# Altium schematic sheet uicc.SchDoc
size A3
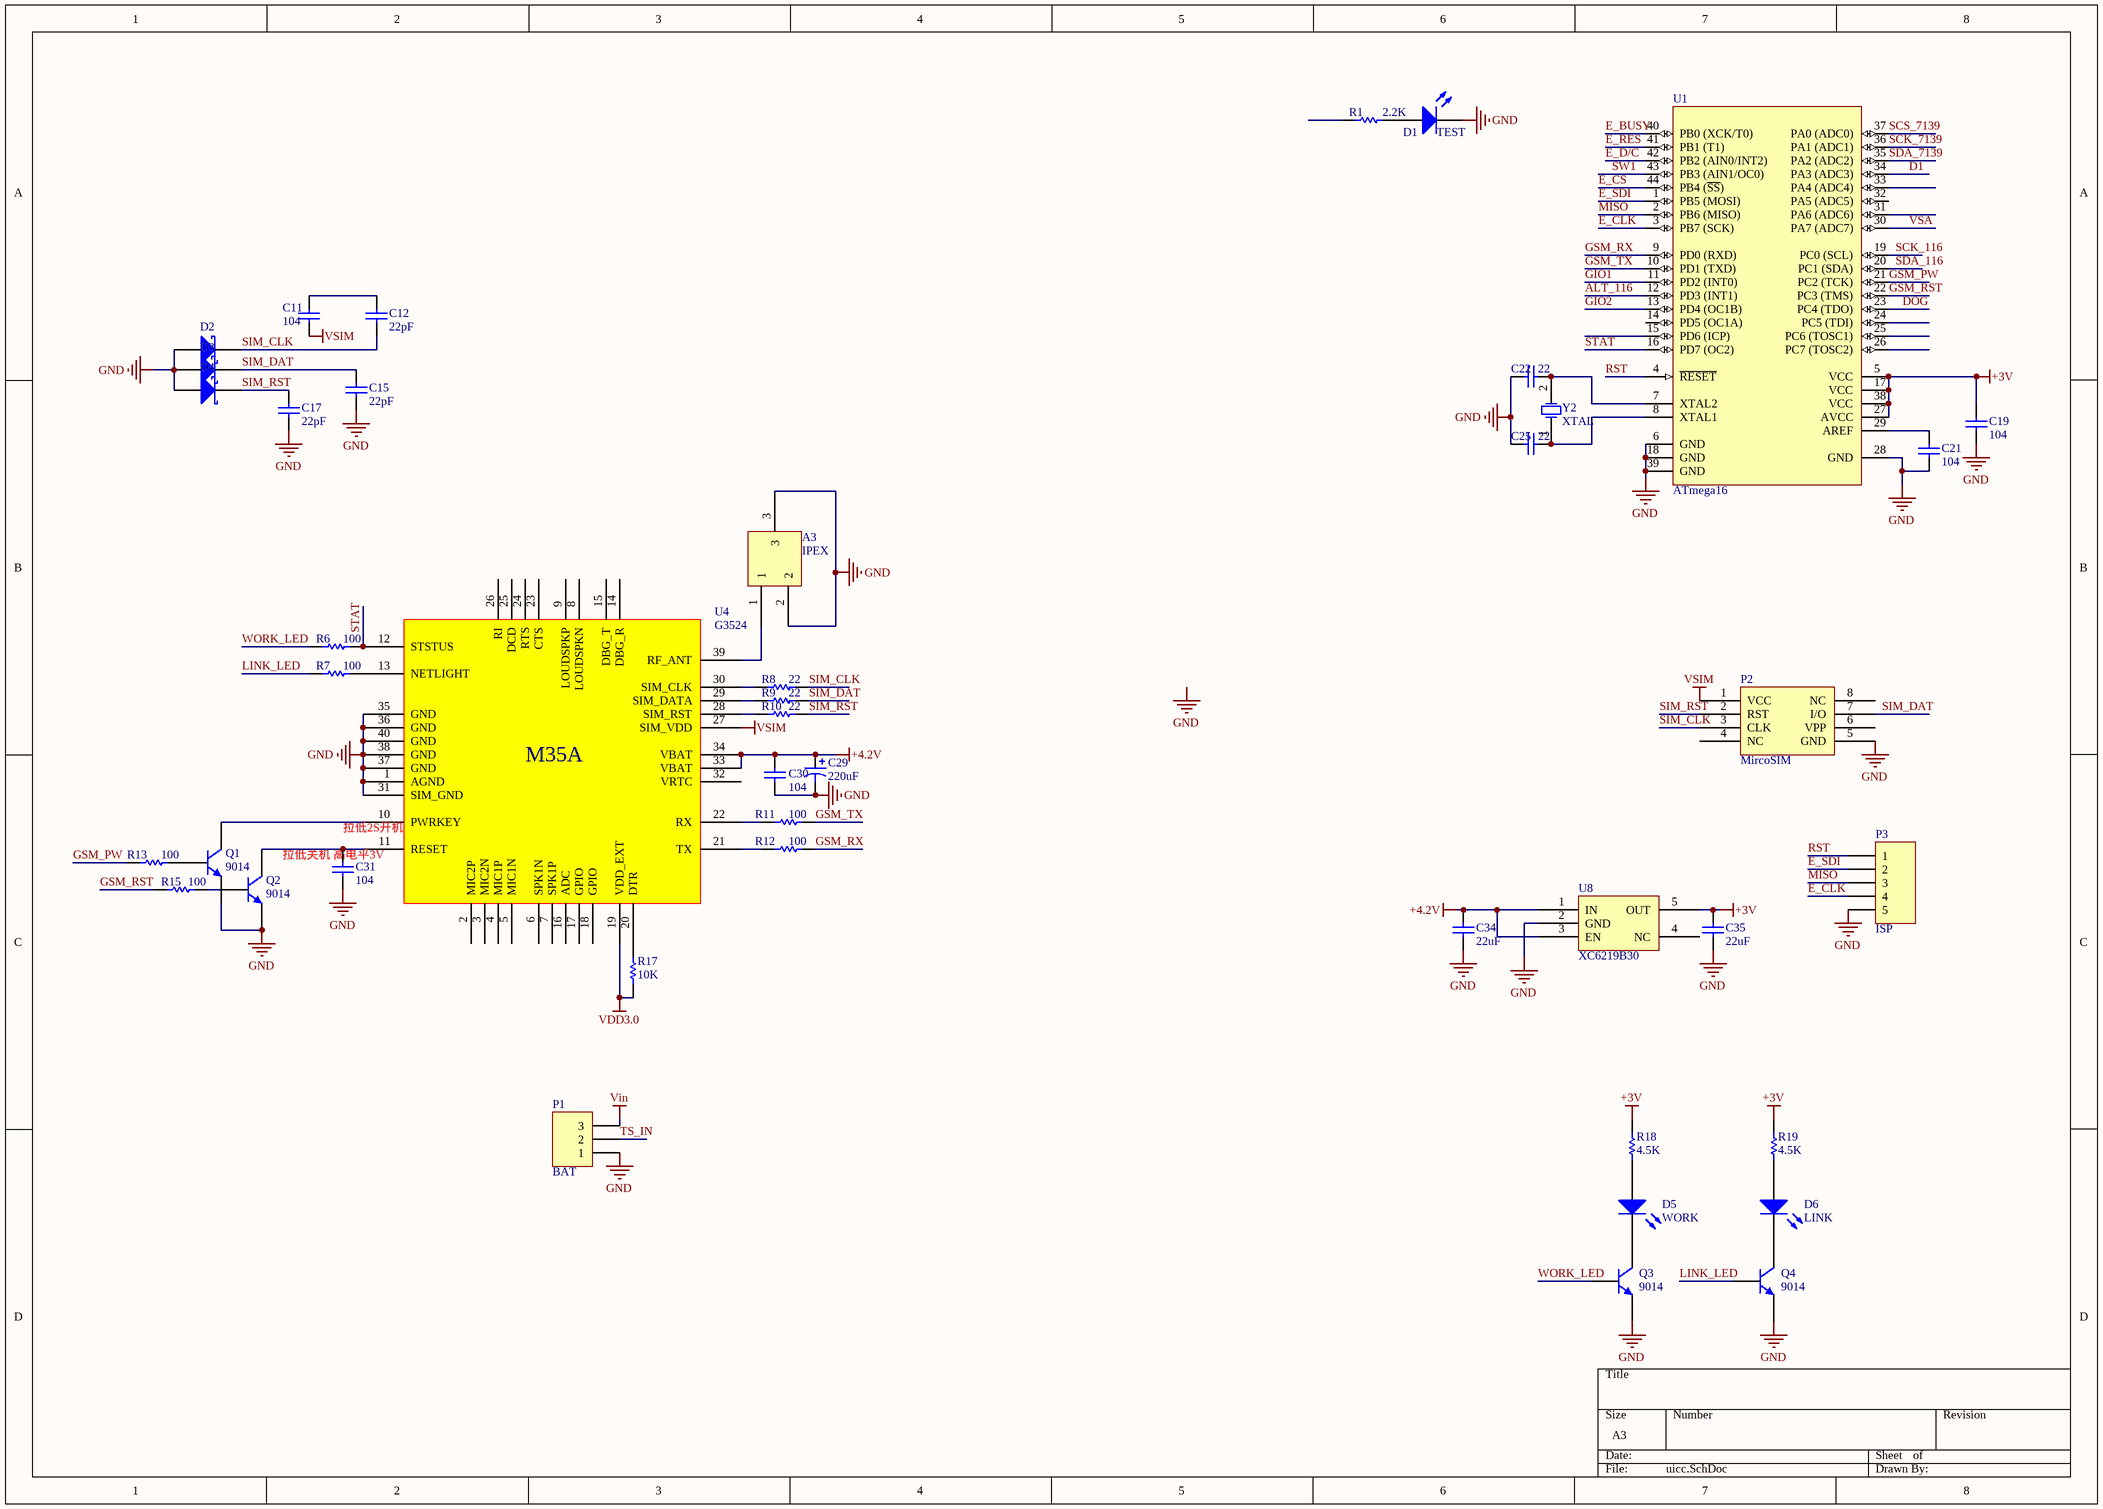
[diagram p0: uicc.SchDoc]

## Parts
A3  IPEX  [IPEX]
C11  value 104  [0603]  (hidden comment: Cap)
C12  value 22pF  [0603]  (hidden comment: Cap)
C15  value 22pF  [0603]  (hidden comment: Cap)
C17  value 22pF  [0603]  (hidden comment: Cap)
C19  value 104  [0603]  (hidden comment: Cap)
C21  value 104  [0603]  (hidden comment: Cap)
C22  value 22  [0603]  (hidden comment: Cap)
C25  value 22  [0603]  (hidden comment: Cap)
C29  value 220uF  [C7343]  (hidden comment: Cap Pol3)
C30  value 104  [0603]  (hidden comment: Cap)
C31  value 104  [0603]  (hidden comment: Cap)
C34  value 22uF  [3216[1206]]  (hidden comment: Cap)
C35  value 22uF  [3216[1206]]  (hidden comment: Cap)
D1  TEST  [0603-LED]
D2  RL0603E012M100K  [0603]  (value not drawn)
D3  RL0603E012M100K  [0603]  (value not drawn)
D4  RL0603E012M100K  [0603]  (value not drawn)
D5  WORK  [0603-LED]
D6  LINK  [0603-LED]
P1  BAT  [1.25-3P]
P2  MircoSIM  [Micro SIM]
P3  ISP  [HDR1X5]
Q1  value 9014  [SOT-23-NPN]  (hidden comment: NPN)
Q2  value 9014  [SOT-23-NPN]  (hidden comment: NPN)
Q3  value 9014  [SOT-23-NPN]  (hidden comment: NPN)
Q4  value 9014  [SOT-23-NPN]  (hidden comment: NPN)
R1  value 2.2K  [0603]  (hidden comment: Res1)
R6  value 100  [0603]  (hidden comment: Res1)
R7  value 100  [0603]  (hidden comment: Res1)
R8  value 22  [0603]  (hidden comment: Res1)
R9  value 22  [0603]  (hidden comment: Res1)
R10  value 22  [0603]  (hidden comment: Res1)
R11  value 100  [0603]  (hidden comment: Res1)
R12  value 100  [0603]  (hidden comment: Res1)
R13  value 100  [0603]  (hidden comment: Res1)
R15  value 100  [0603]  (hidden comment: Res1)
R17  value 10K  [0603]  (hidden comment: Res1)
R18  value 4.5K  [0603]  (hidden comment: Res1)
R19  value 4.5K  [0603]  (hidden comment: Res1)
U1  ATmega16  [44A_M]
U4  G3524  [G3524]
U8  XC6219B30  [SOT23-5N]
Y2  XTAL  [XT5032]

## Nets
+3V: C19.1 C35.1 R18.1 R19.1 U1.5(VCC) U1.17(VCC) U1.27(AVCC) U1.38(VCC) U8.5(OUT)
+4.2V: C29.1 C30.2 C34.1 U4.33(VBAT) U4.34(VBAT) U8.1(IN) U8.3(EN)
GND: A3.2 A3.3 C15.2 C17.2 C19.2 C21.2 C22.2 C25.2 C29.2 C30.1 C31.2 C34.2 C35.2 D1.2(K) D2.2(A) D3.2(A) D4.2(A) P1.1 P2.5(GND) P3.5 Q1.1(E) Q2.1(E) Q3.1(E) Q4.1(E) U1.6(GND) U1.18(GND) U1.28(GND) U1.39(GND) U4.1(AGND) U4.31(SIM_GND) U4.35(GND) U4.36(GND) U4.37(GND) U4.38(GND) U4.40(GND) U8.2(GND)
VDD3.0: R17.2 U4.19(VDD_EXT)
Vin: P1.3
VSIM: C11.2 P2.1(VCC) U4.27(SIM_VDD)
ALT_116: U1.12(PD3_(INT1))
D1: U1.34(PA3_(ADC3))
DOG: U1.23(PC4_(TDO))
E_BUSY: U1.40(PB0_(XCK/T0))
E_CLK: P3.4 U1.3(PB7_(SCK))
E_CS: U1.44(PB4_(~{SS}))
E_D/C: U1.42(PB2_(AIN0/INT2))
E_RES: U1.41(PB1_(T1))
E_SDI: P3.2 U1.1(PB5_(MOSI))
GIO1: U1.11(PD2_(INT0))
GIO2: U1.13(PD4_(OC1B))
GSM_PW: R13.2 U1.21(PC2_(TCK))
GSM_RST: R15.2 U1.22(PC3_(TMS))
GSM_RX: R12.2 U1.9(PD0_(RXD))
GSM_TX: R11.2 U1.10(PD1_(TXD))
LINK_LED: Q4.2(B) R7.2
MISO: P3.3 U1.2(PB6_(MISO))
RST: P3.1 U1.4(~{RESET})
SCK_116: U1.19(PC0_(SCL))
SCK_7139: U1.36(PA1_(ADC1))
SCS_7139: U1.37(PA0_(ADC0))
SDA_116: U1.20(PC1_(SDA))
SDA_7139: U1.35(PA2_(ADC2))
SIM_CLK: C12.2 D2.1(K) P2.3(CLK) R8.1
SIM_DAT: C15.1 D3.1(K) P2.7(I/O) R9.1
SIM_RST: C17.1 D4.1(K) P2.2(RST) R10.1
STAT: R6.1 U1.16(PD7_(OC2)) U4.12(STSTUS)
SW1: U1.43(PB3_(AIN1/OC0))
TS_IN: P1.2
VSA: U1.30(PA7_(ADC7))
WORK_LED: Q3.2(B) R6.2
NetA3_1: A3.1 U4.39(RF_ANT)
NetC11_1: C11.1 C12.1
NetC21_1: C21.1 U1.29(AREF)
NetC22_1: C22.1 U1.7(XTAL2) Y2.2(OSC2)
NetC25_1: C25.1 U1.8(XTAL1) Y2.1(OSC1)
NetC31_1: C31.1 Q2.3(C) U4.11(RESET)
NetD1_1: D1.1(A) R1.2
NetD5_1: D5.1(A) R18.2
NetD5_2: D5.2(K) Q3.3(C)
NetD6_1: D6.1(A) R19.2
NetD6_2: D6.2(K) Q4.3(C)
NetQ1_2: Q1.2(B) R13.1
NetQ1_3: Q1.3(C) U4.10(PWRKEY)
NetQ2_2: Q2.2(B) R15.1
NetR7_1: R7.1 U4.13(NETLIGHT)
NetR8_2: R8.2 U4.30(SIM_CLK)
NetR9_2: R9.2 U4.29(SIM_DATA)
NetR10_2: R10.2 U4.28(SIM_RST)
NetR11_1: R11.1 U4.22(RX)
NetR12_1: R12.1 U4.21(TX)
NetR17_1: R17.1 U4.20(DTR)

Not connected (* = marked no-connect by the designer): P2 4(NC) 6(VPP) 8(NC); R1 1; U1 14(PD5_(OC1A)) 15(PD6_(ICP)) 24(PC5_(TDI)) 25(PC6_(TOSC1)) 26(PC7_(TOSC2)) 31(PA6_(ADC6)) 32(PA5_(ADC5)) 33(PA4_(ADC4)); U4 2(MIC2P) 3(MIC2N) 4(MIC1P) 5(MIC1N) 6(SPK1N) 7(SPK1P) 8(LOUDSPKN) 9(LOUDSPKP) 14(DBG_R) 15(DBG_T) 16(ADC) 17(GPIO) 18(GPIO) 23(CTS) 24(RTS) 25(DCD) 26(RI) 32(VRTC); U8 4(NC)

## Notes on the sheet
- (near C31) 拉低关机 高电平3V
- 拉低2S开机
- Labels drawn without touching a wire or pin: GND
- (in symbol G3524) M35A

## Library data of the parts
C11 C12 C15 C17 C19 C21 C22 C25 C30 C31 C34 C35 = Cap: Capacitor; Published: 8-Jun-2000; LatestRevisionDate: 17-Jul-2002; LatestRevisionNote: Re-released for DXP Platform.; PackageReference: RAD-0.3; Publisher: Altium Limited
C29 = Cap Pol3: Polarized Capacitor (Surface Mount); Published: 8-Jun-2000; LatestRevisionDate: 17-Jul-2002; LatestRevisionNote: Re-released for DXP Platform.; PackageReference: C0805; Publisher: Altium Limited
D1 D5 D6 = LED2: Typical RED, GREEN, YELLOW, AMBER GaAs LED; Value: GRN; Published: 8-Jun-2000; LatestRevisionDate: 17-Jul-2002; LatestRevisionNote: Re-released for DXP Platform.; PackageDocument: Feb-2002; PackageReference: 3.2X1.6X1.1; Publisher: Altium Limited
D2-D4 = Diode 18TQ045: Schottky Rectifier; Note: Terminal 2 is the TAB and is electrically connected to the cathode; Value: SMBJ45CA; Published: 8-Jun-2000; LatestRevisionDate: 17-Jul-2002; LatestRevisionNote: Re-released for DXP Platform.; DatasheetDocument: Dec-1997; PackageDocument: Feb-1998; PackageReference: TO-220AC; Publisher: Altium Limited; ComponentLink1Description: Manufacturer Link; ComponentLink1URL: http://www.irf.com/; ComponentLink2Description: Datasheet; ComponentLink2URL: http://www.irf.com/product-info/datasheets/data/18tq.pdf
P1 = Header 3: Header, 3-Pin; LatestRevisionDate: 17-Jul-2002; LatestRevisionNote: Re-released for DXP Platform.; Publisher: Altium Limited
P3 = Header 5: Header, 5-Pin; LatestRevisionDate: 17-Jul-2002; LatestRevisionNote: Re-released for DXP Platform.; Publisher: Altium Limited
Q1-Q4 = 2N5551: NPN General Purpose Amplifier; Published: 8-Jun-2000; LatestRevisionDate: 17-Jan-2003; LatestRevisionNote: PCB Footprint 'BCY-W3/D4.7' replaced; DatasheetDocument: 1997; PackageDocument: Sep-1998; PackageReference: TO-92A; Publisher: Altium Limited; ComponentLink1Description: Manufacturer Link; ComponentLink1URL: http://www.fairchildsemi.com/; ComponentLink2Description: Datasheet; ComponentLink2URL: http://www.fairchildsemi.com/ds/2N%2F2N5551.pdf
R1 R6-R13 R15 R17-R19 = Res1: Resistor; Published: 8-Jun-2000; LatestRevisionDate: 17-Jul-2002; LatestRevisionNote: Re-released for DXP Platform.; PackageReference: AXIAL-0.3; Publisher: Altium Limited
U1 = ATmega16-16AI: 8-Bit AVR Microcontroller with 16K Bytes of In-System Programmable Flash Memory; Published: 17-Sep-2003; LatestRevisionDate: 13-Apr-2006; LatestRevisionNote: IPC-7351 Footprint Added.; DatasheetVersion: 2466E-AVR-10/02; PackageVersion: rev.B, Oct-2001; PackageReference: 44A; Publisher: Altium Limited; PackageDescription: 44-Pin Thin Quad Flat Pack 0.8 mm Pitch; ComponentLink1Description: Manufacturer Link; ComponentLink1URL: http://www.atmel.com; ComponentLink2Description: Datasheet; ComponentLink2URL: http://www.atmel.com/dyn/resources/prod_documents/doc2466.pdf
U8 = LP5907: Value: LP5907
Y2 = XTAL: Crystal Oscillator; Published: 8-Jun-2000; LatestRevisionDate: 17-Jul-2002; LatestRevisionNote: Re-released for DXP Platform.; PackageReference: R38; Publisher: Altium Limited